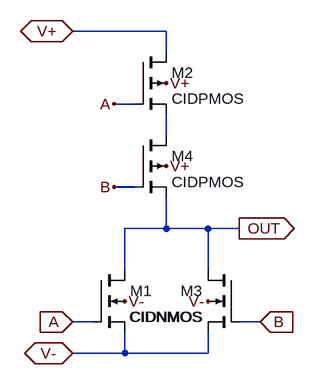
[diagram p0: schematic NOR2X1.asc]
NOR2X1.asc, the LTspice schematic file:
Version 4.1
SHEET 1 880 680
WIRE 192 -160 48 -160
WIRE 192 -128 192 -160
WIRE 144 -48 112 -48
WIRE 192 0 192 -32
WIRE 144 80 112 80
WIRE 192 144 192 96
WIRE 192 144 128 144
WIRE 256 144 192 144
WIRE 304 144 256 144
WIRE 128 208 128 144
WIRE 256 208 256 144
WIRE 80 288 48 288
WIRE 336 288 304 288
WIRE 128 336 128 304
WIRE 128 336 48 336
WIRE 256 336 256 304
WIRE 256 336 128 336
FLAG 48 288 A
IOPIN 48 288 In
FLAG 336 288 B
IOPIN 336 288 In
FLAG 304 144 OUT
IOPIN 304 144 Out
FLAG 112 -48 A
FLAG 112 80 B
FLAG 48 -160 V+
IOPIN 48 -160 BiDir
FLAG 256 256 V-
FLAG 128 256 V-
FLAG 192 -80 V+
FLAG 192 48 V+
FLAG 48 336 V-
IOPIN 48 336 BiDir
SYMBOL nmos4 80 208 R0
SYMATTR InstName M1
SYMATTR Value CIDNMOS
SYMATTR Value2 l=5u w=10u
SYMBOL pmos4 144 -128 R0
SYMATTR InstName M2
SYMATTR Value CIDPMOS
SYMATTR Value2 l=5u w=50u
SYMBOL nmos4 304 208 M0
SYMATTR InstName M3
SYMATTR Value CIDNMOS
SYMATTR Value2 l=5u w=10u
SYMBOL pmos4 144 0 R0
SYMATTR InstName M4
SYMATTR Value CIDPMOS
SYMATTR Value2 l=5u w=50u

The netlist it stands for:
* NOR2X1.asc
M1 OUT A V- V- CIDNMOS l=5u w=10u
M2 V+ A N001 V+ CIDPMOS l=5u w=50u
M3 OUT B V- V- CIDNMOS l=5u w=10u
M4 N001 B OUT V+ CIDPMOS l=5u w=50u
.model NMOS NMOS
.model PMOS PMOS
.lib standard.mos
.backanno
.end